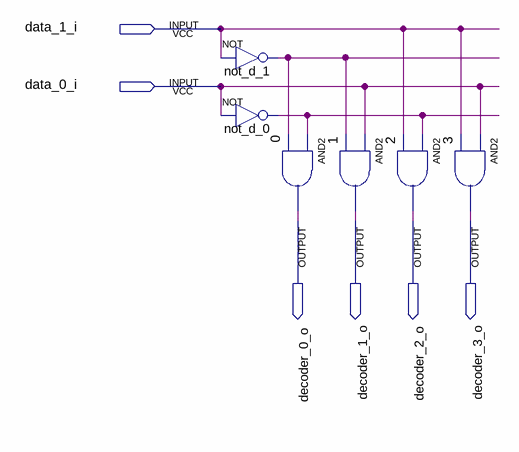
[diagram p0: schematic sheet]
// Quartus schematic decoder.bdf as structural Verilog: 6 symbols, 6 pins
module decoder (
  input  data_1_i,
  input  data_0_i,
  output decoder_0_o,
  output decoder_1_o,
  output decoder_2_o,
  output decoder_3_o
);

  wire not_d_0_out, not_d_1_out;

  not not_d_1 (not_d_1_out, data_1_i);
  not not_d_0 (not_d_0_out, data_0_i);
  and u_0 (decoder_0_o, not_d_0_out, not_d_1_out);
  and u_1 (decoder_1_o, data_0_i, not_d_1_out);
  and u_2 (decoder_2_o, not_d_0_out, data_1_i);
  and u_3 (decoder_3_o, data_0_i, data_1_i);
endmodule
